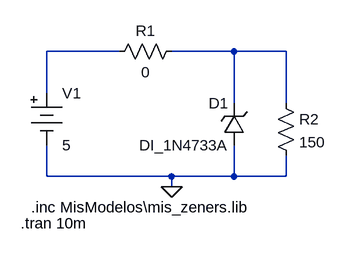
[diagram p0: schematic Zener1N4733Bateria5V.asc]
Zener1N4733Bateria5V.asc, the LTspice schematic file:
Version 4.1
SHEET 1 880 680
WIRE 160 80 48 80
WIRE 336 80 240 80
WIRE 416 80 336 80
WIRE 48 144 48 80
WIRE 336 160 336 80
WIRE 416 160 416 80
WIRE 48 272 48 224
WIRE 240 272 48 272
WIRE 336 272 336 224
WIRE 336 272 240 272
WIRE 416 272 416 240
WIRE 416 272 336 272
WIRE 240 288 240 272
FLAG 240 288 0
SYMBOL Misc\\battery 48 128 R0
SYMATTR InstName V1
SYMATTR Value 5
SYMBOL res 256 64 R90
WINDOW 0 0 56 VBottom 2
WINDOW 3 32 56 VTop 2
SYMATTR InstName R1
SYMATTR Value 0
SYMBOL res 400 144 R0
SYMATTR InstName R2
SYMATTR Value 150
SYMBOL zener 352 224 R180
WINDOW 0 24 64 Left 2
WINDOW 3 24 0 Left 2
SYMATTR InstName D1
SYMATTR Value DI_1N4733A
SYMATTR Prefix x
TEXT 24 320 Left 2 !.inc MisModelos\\mis_zeners.lib
TEXT 8 344 Left 2 !.tran 10m

The netlist it stands for:
* Zener1N4733Bateria5V.asc
V1 N001 0 5
R1 N002 N001 0
R2 N002 0 150
X§D1 0 N002 DI_1N4733A  ; pins + -
.inc MisModelos\mis_zeners.lib
.tran 10m
.backanno
.end